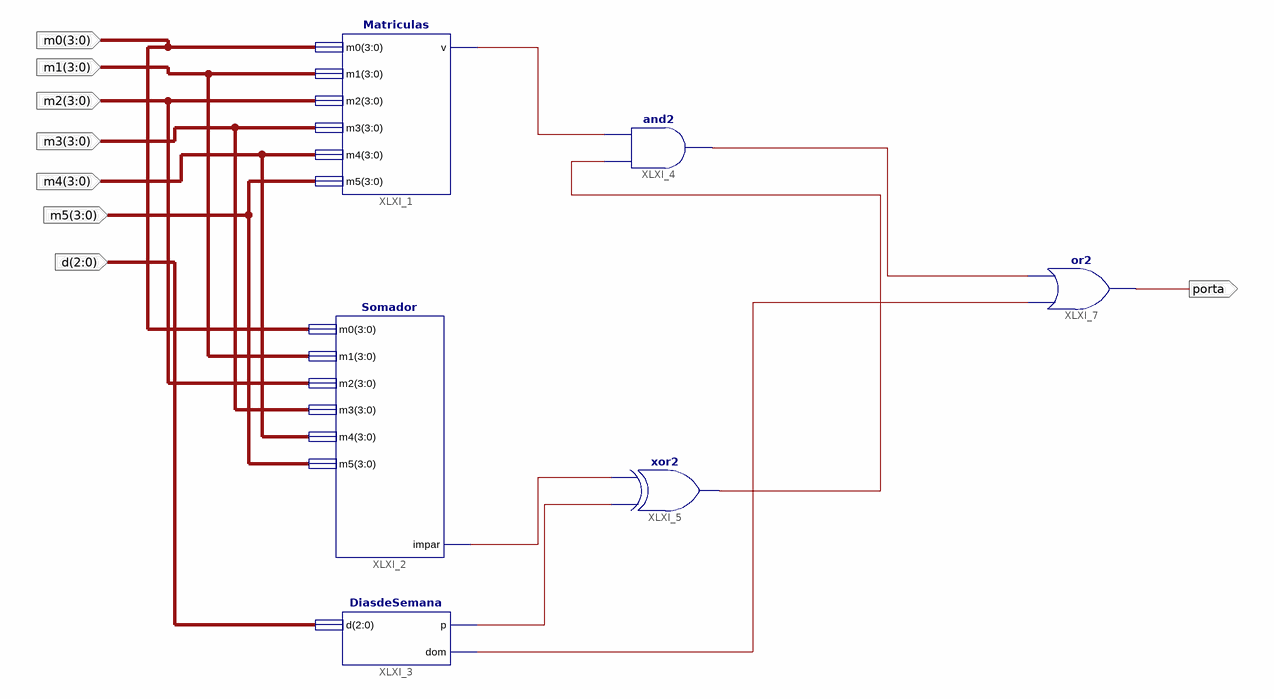
[diagram p0: schematic sheet 1]
// Xilinx ISE schematic Resultado.sch (spartan6) as structural Verilog: 6 symbols, 8 ports
module Resultado (
  input  [3:0] m0,
  input  [3:0] m1,
  input  [3:0] m2,
  input  [3:0] m3,
  input  [3:0] m4,
  input  [3:0] m5,
  input  [2:0] d,
  output porta
);

  wire XLXN_18, XLXN_21, XLXN_22, XLXN_24, XLXN_25, XLXN_29;

  Matriculas XLXI_1 (.m0(m0), .m1(m1), .m2(m2), .m3(m3), .m4(m4), .m5(m5), .v(XLXN_22));
  Somador XLXI_2 (.m0(m0), .m1(m1), .m2(m2), .m3(m3), .m4(m4), .m5(m5), .impar(XLXN_29));
  DiasdeSemana XLXI_3 (.d(d), .p(XLXN_21), .dom(XLXN_24));
  and XLXI_4 (XLXN_25, XLXN_18, XLXN_22);
  xor XLXI_5 (XLXN_18, XLXN_21, XLXN_29);
  or XLXI_7 (porta, XLXN_24, XLXN_25);
endmodule
